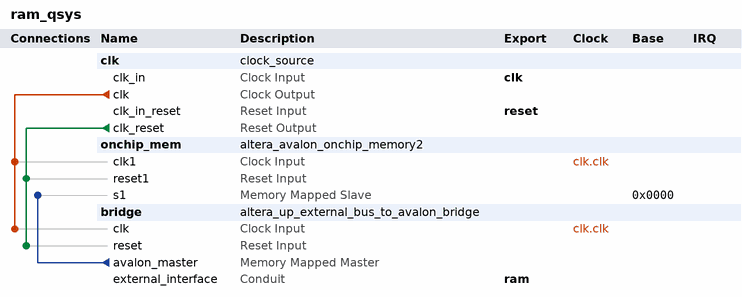
[diagram p0: system contents]
# Platform Designer (Qsys) system ram_qsys, MAX 10 10M50DAF484C7G
# Parameters at their usual value, and those the tool derives, are not listed.
package require -exact qsys 20.1
create_system ram_qsys
set_project_property DEVICE_FAMILY {MAX 10}
set_project_property DEVICE 10M50DAF484C7G

add_instance clk clock_source 20.1
set_instance_parameter_value clk clockFrequency 50000000

add_instance onchip_mem altera_avalon_onchip_memory2 20.1
set_instance_parameter_value onchip_mem allowInSystemMemoryContentEditor true
set_instance_parameter_value onchip_mem dataWidth 64
set_instance_parameter_value onchip_mem dualPort false
set_instance_parameter_value onchip_mem initMemContent true
set_instance_parameter_value onchip_mem initializationFileName C:/Users/varun/Documents/Projects/FPGA/FFT/FFT.mif
set_instance_parameter_value onchip_mem instanceID RAM
set_instance_parameter_value onchip_mem memorySize 16384
set_instance_parameter_value onchip_mem useNonDefaultInitFile true

add_instance bridge altera_up_external_bus_to_avalon_bridge 18.0
set_instance_parameter_value bridge addr_size 16
set_instance_parameter_value bridge addr_size_multiplier Kbytes
set_instance_parameter_value bridge data_size 64

# connections
add_connection clk.clk bridge.clk clock
add_connection clk.clk onchip_mem.clk1 clock
add_connection clk.clk_reset bridge.reset reset
add_connection clk.clk_reset onchip_mem.reset1 reset
add_connection bridge.avalon_master onchip_mem.s1 avalon
set_connection_parameter_value bridge.avalon_master/onchip_mem.s1 baseAddress 0x0000

# exported interfaces
add_interface clk clock sink
set_interface_property clk EXPORT_OF clk.clk_in
add_interface ram conduit end
set_interface_property ram EXPORT_OF bridge.external_interface
add_interface reset reset sink
set_interface_property reset EXPORT_OF clk.clk_in_reset

set_interconnect_requirement {$system} qsys_mm.clockCrossingAdapter HANDSHAKE
set_interconnect_requirement {$system} qsys_mm.enableEccProtection FALSE
set_interconnect_requirement {$system} qsys_mm.insertDefaultSlave FALSE
set_interconnect_requirement {$system} qsys_mm.maxAdditionalLatency 1

save_system ram_qsys.qsys
